# EAGLE design WZ2432R028-ESP32-V1.0-20230327 (EAGLE 9.5.1)
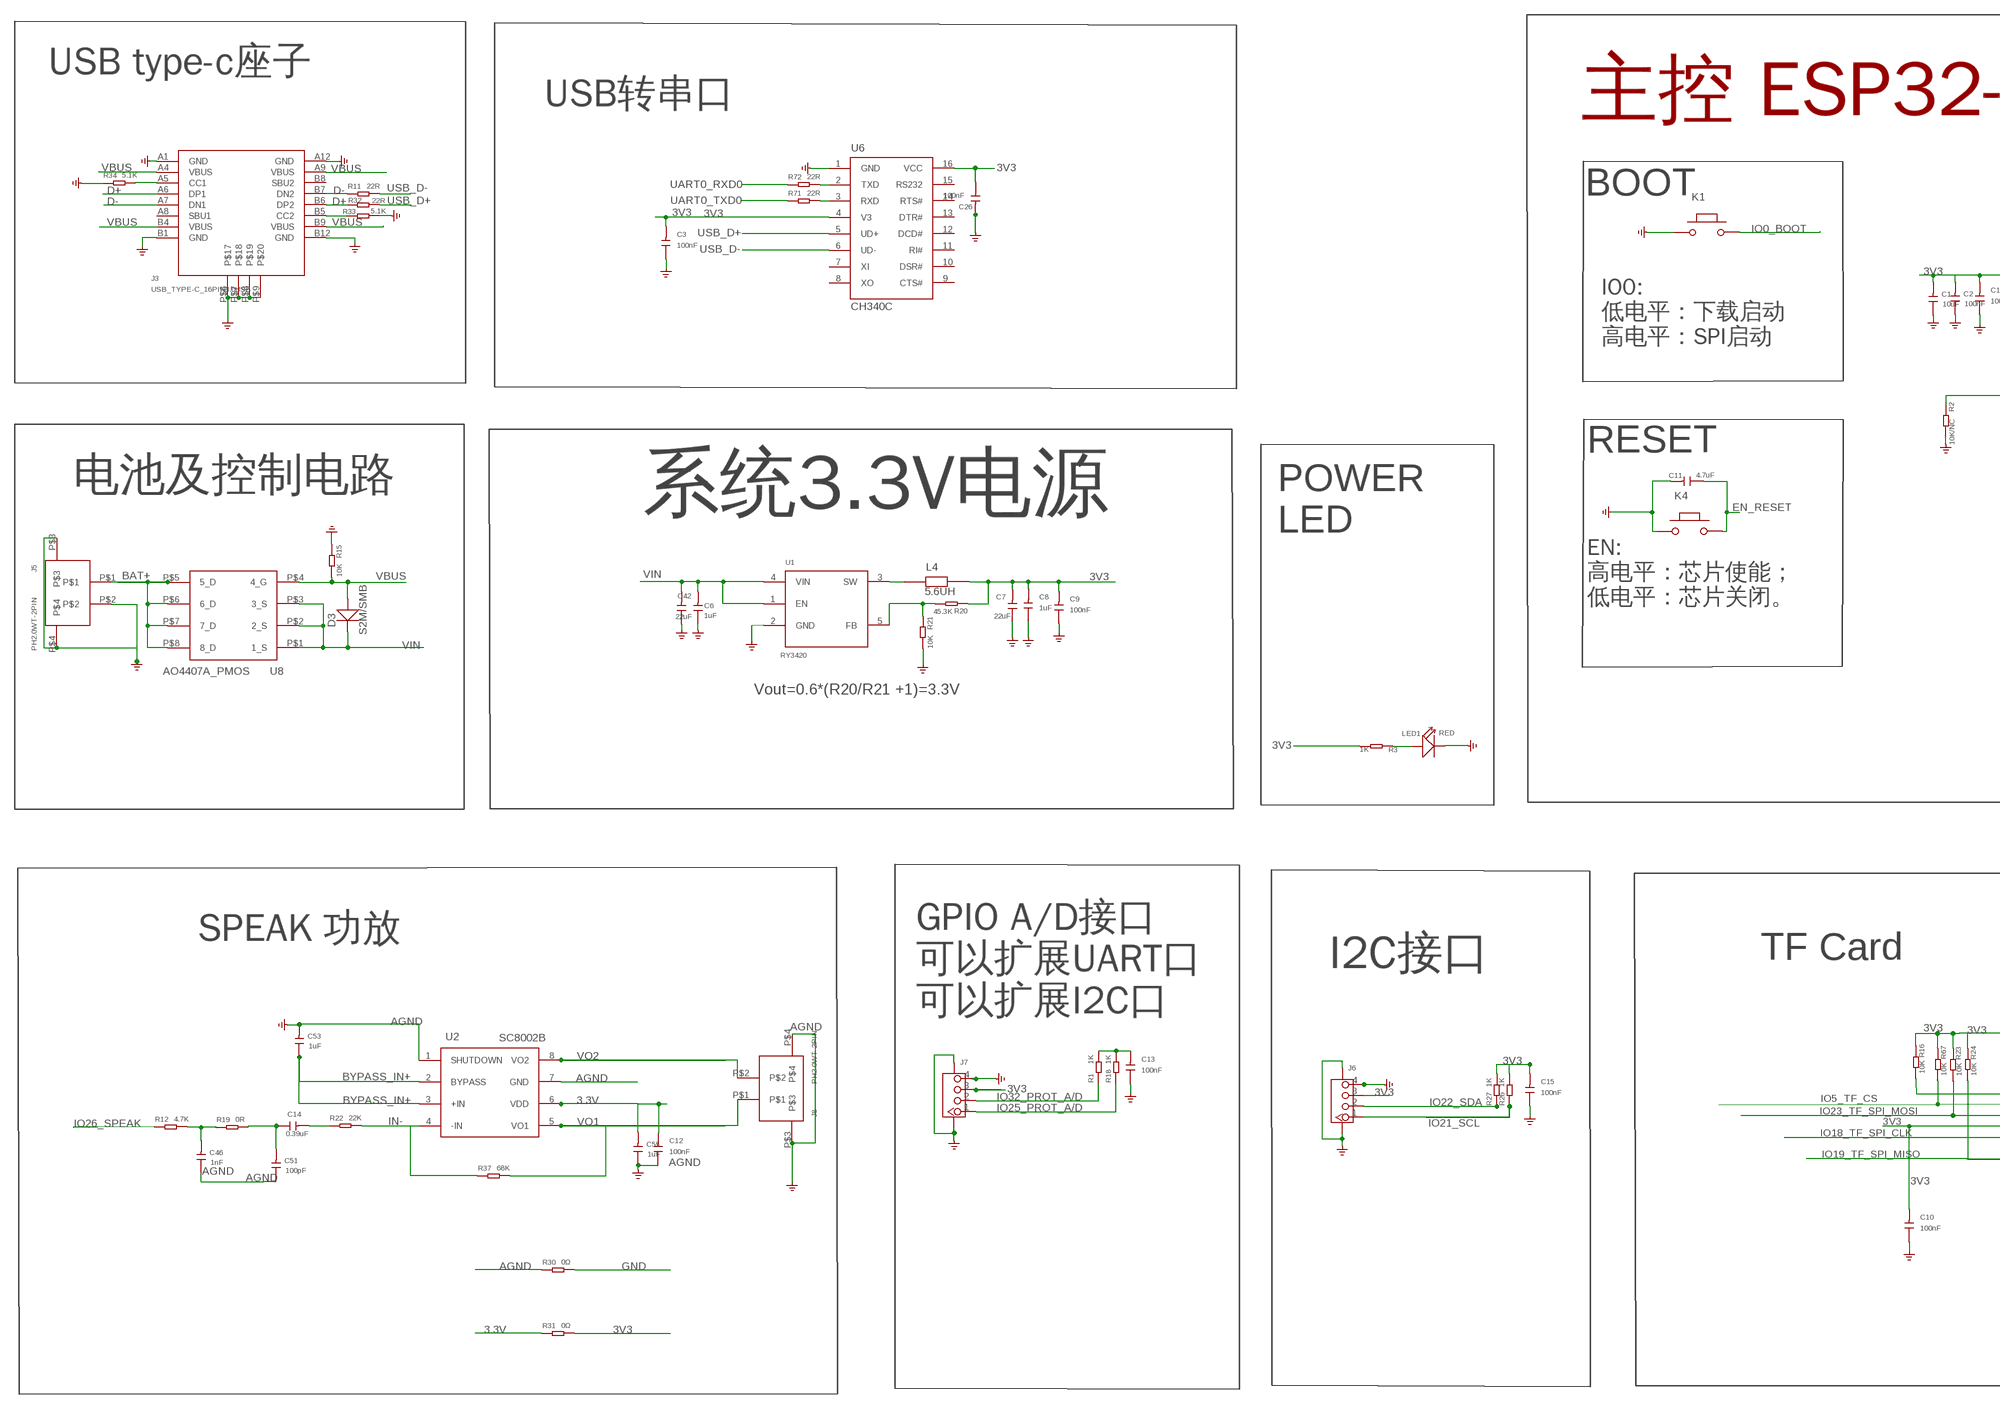
[diagram p0: schematic, sheet 1, part 1 of 2]
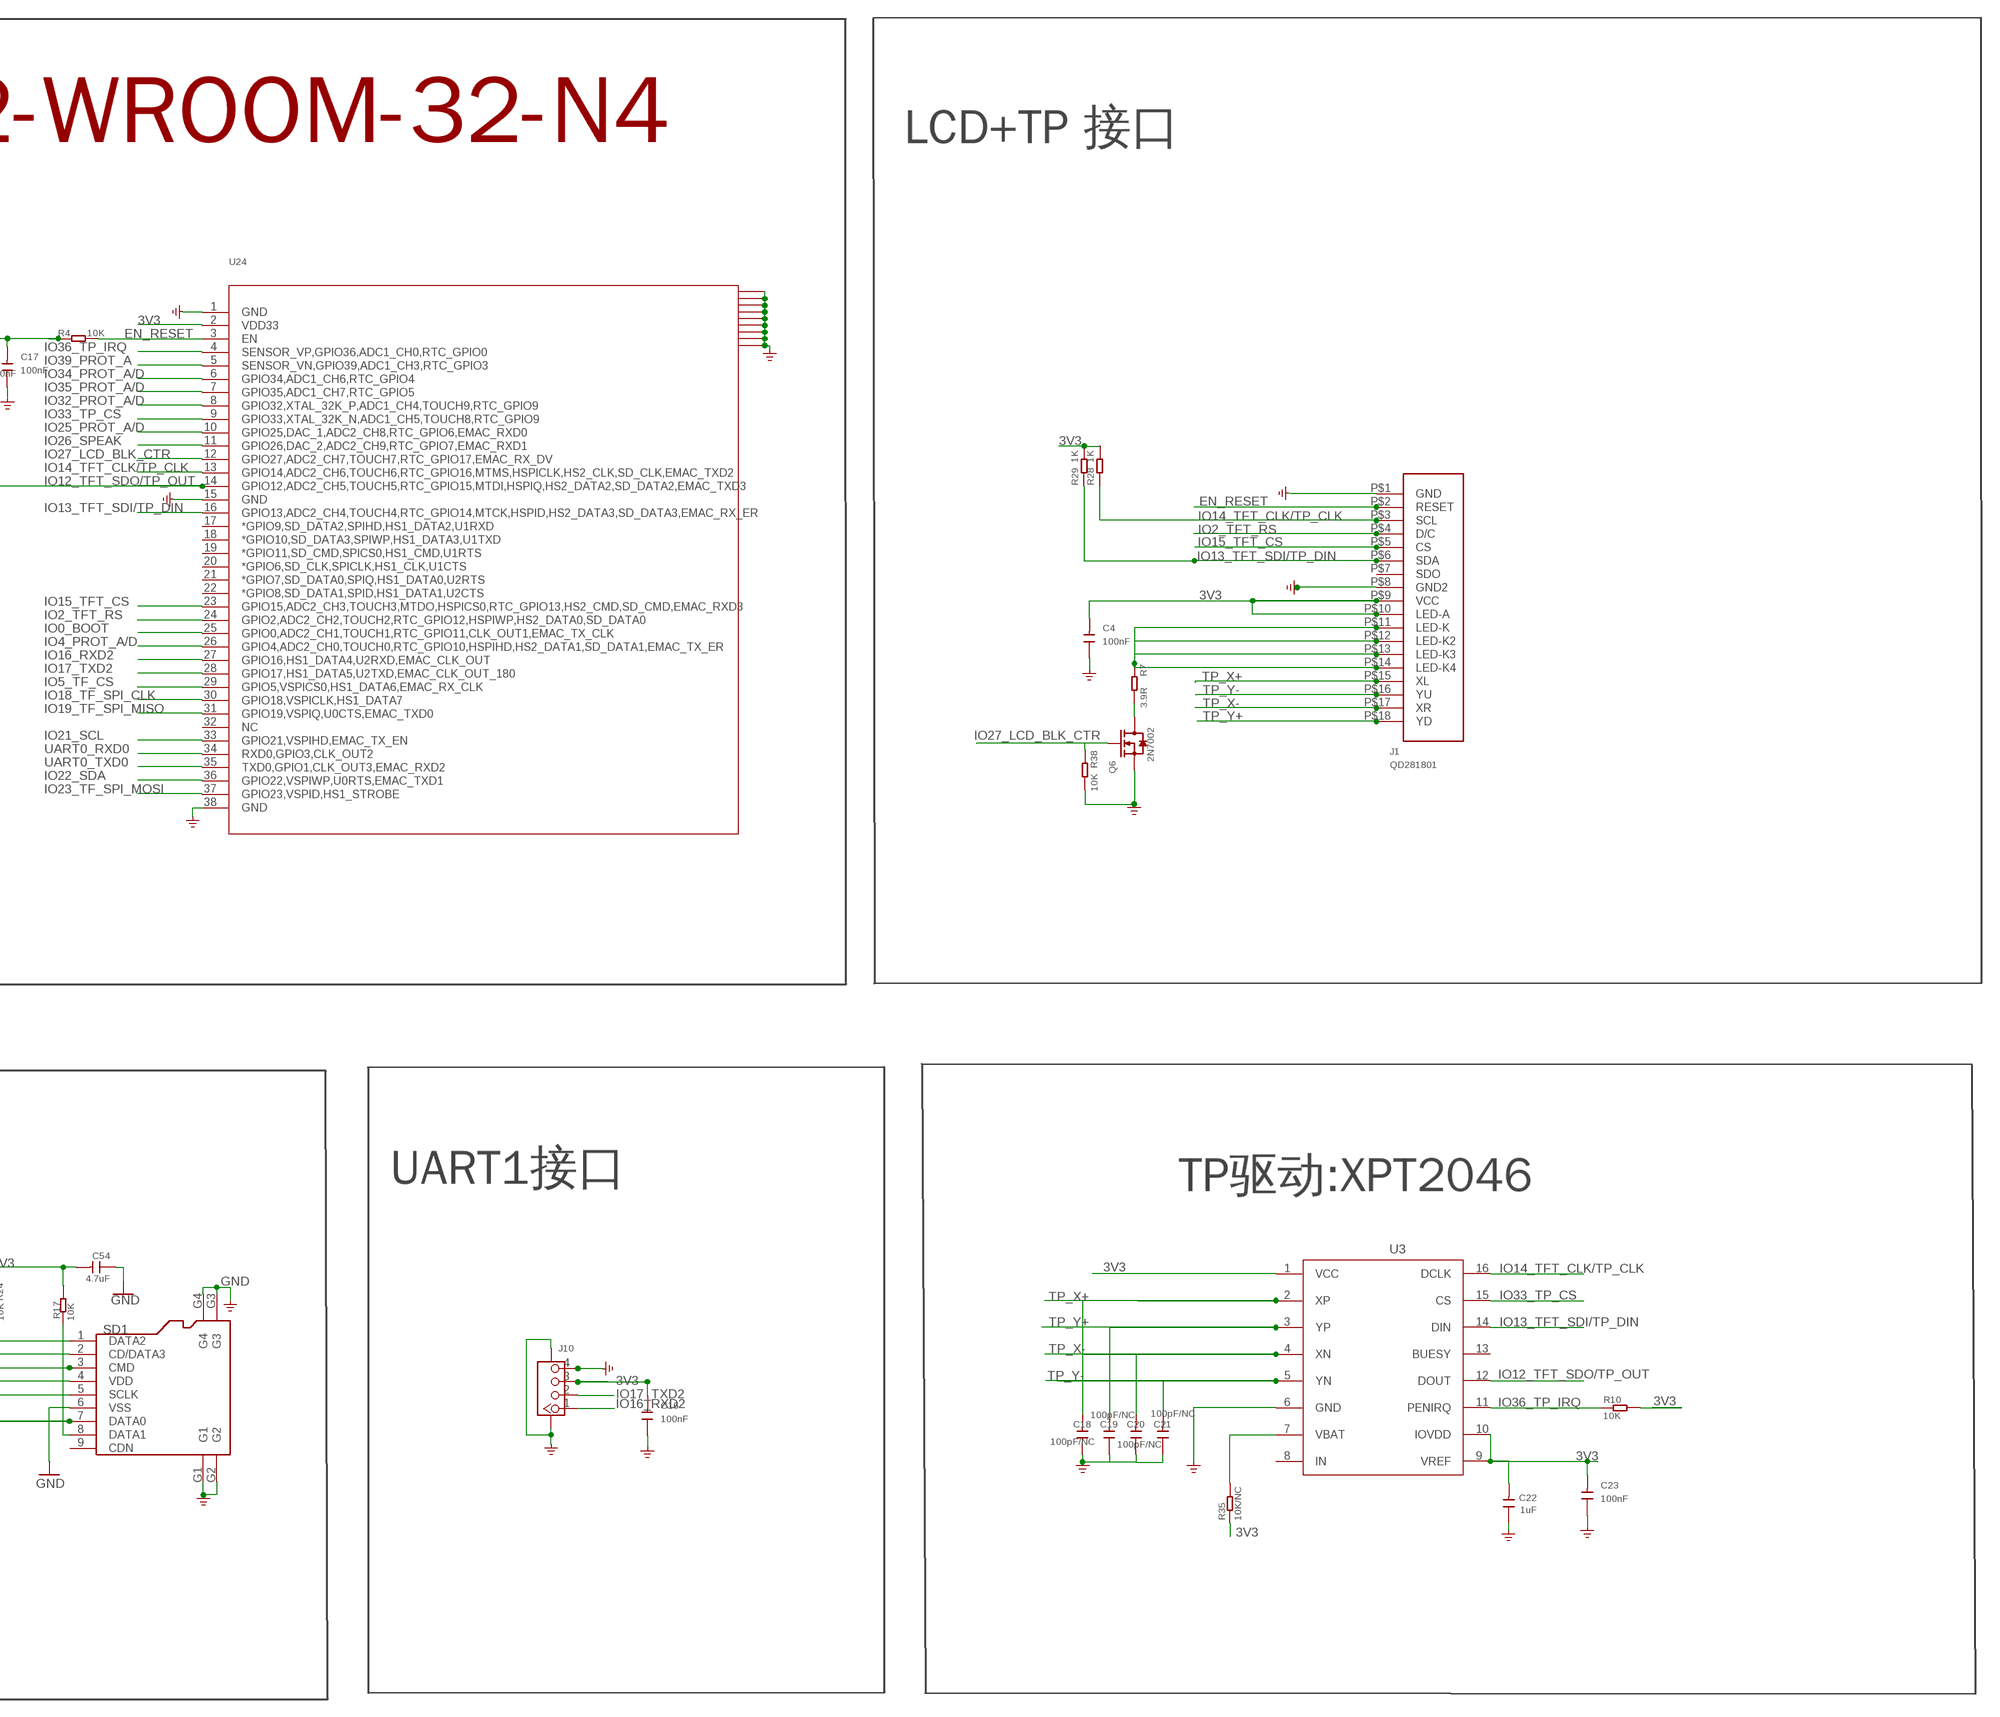
[diagram p1: schematic, sheet 1, part 2 of 2]

## Parts
C1  10uF  DISCRETE_C-0603  [DISCRETE_C0603]
C2  100nF  DISCRETE_C-0603  [DISCRETE_C0603]
C3  100nF  C0603  [0603]
C4  100nF  C0603  [0603]
C6  1uF  C0603  [0603]
C7  22uF  C0805  [0805]
C8  1uF  C0603  [0603]
C9  100nF  C0603  [0603]
C10  100nF  C0603  [0603]
C11  4.7uF  C0603  [0603]
C12  100nF  C0603  [0603]
C13  100nF  C0603  [0603]
C14  0.39uF  DISCRETE_C-0603  [DISCRETE_C0603]
C15  100nF  C0603  [0603]
C16  100nF  C0603  [0603]
C17  100nF  C0603  [0603]
C18  100pF/NC  C0603  [0603]
C19  100pF/NC  C0603  [0603]
C20  100pF/NC  C0603  [0603]
C21  100pF/NC  C0603  [0603]
C22  1uF  DISCRETE_C-0603  [DISCRETE_C0603]
C23  100nF  C0603  [0603]
C26  100nF  C0603  [0603]
C42  22uF  C0805  [0805]
C46  1nF  DISCRETE_C-0603  [DISCRETE_C0603]
C51  100pF  DISCRETE_C-0603  [DISCRETE_C0603]
C53  1uF  DISCRETE_C-0603  [DISCRETE_C0603]
C54  4.7uF  DISCRETE_C-0603  [DISCRETE_C0603]
C55  1uF  DISCRETE_C-0603  [DISCRETE_C0603]
D3  S2M/SMB  214ABDO-214AB  [214AB]
J1  QD281801  [QD241801-18PIN*0.8]
J3  USB_TYPE-C_16PIN3.0USB  [KEVIN_3.0TYPEC-SMD]
J5  PH2.0WT-2PIN  [PH2.0WT-2PIN]
J6  CONNECTOR_TWIG-4P-2.0-SMD-FEMALE-REINFORCE90D  [CONNECTOR_4P-SMD-2.0-90D]
J7  CONNECTOR_TWIG-4P-2.0-SMD-FEMALE-REINFORCE90D  [CONNECTOR_4P-SMD-2.0-90D]
J8  PH2.0WT-2PIN  [PH2.0WT-2PIN]
J10  CONNECTOR_TWIG-4P-2.0-SMD-FEMALE-REINFORCE90D  [CONNECTOR_4P-SMD-2.0-90D]
K1  BUTTON  PB157  [157SW]
K4  BUTTON  PB157  [157SW]
L4  5.6UH  CROWPI2-MB-V1.4-20211012_CMP201209UD1R0MT  [CD54]
LED1  RED  DISCRETE_LED0603  [DISCRETE_LED-0603]
Q6  2N7002  MOSFET-N'SOT23'  [SOT23]
R1  1K  DISCRETE_R-0603  [DISCRETE_R0603]
R2  10K/NC  DISCRETE_R-0603  [DISCRETE_R0603]
R3  1K  DISCRETE_R-0603  [DISCRETE_R0603]
R4  10K  R0603  [R0603]
R7  3.9R  DISCRETE_R-0603  [DISCRETE_R0603]
R10  10K  DISCRETE_R-0603  [DISCRETE_R0603]
R11  22R  DISCRETE_R-0603  [DISCRETE_R0603]
R12  4.7K  DISCRETE_R-0603  [DISCRETE_R0603]
R15  10K  DISCRETE_R-0603  [DISCRETE_R0603]
R16  10K  DISCRETE_R-0603  [DISCRETE_R0603]
R17  10K  DISCRETE_R-0603  [DISCRETE_R0603]
R18  1K  DISCRETE_R-0603  [DISCRETE_R0603]
R19  0R  DISCRETE_R-0603  [DISCRETE_R0603]
R20  45.3K  DISCRETE_R-0603  [DISCRETE_R0603]
R21  10K  DISCRETE_R-0603  [DISCRETE_R0603]
R22  22K  DISCRETE_R-0603  [DISCRETE_R0603]
R23  10K  DISCRETE_R-0603  [DISCRETE_R0603]
R24  10K  DISCRETE_R-0603  [DISCRETE_R0603]
R26  1K  DISCRETE_R-0603  [DISCRETE_R0603]
R27  1K  DISCRETE_R-0603  [DISCRETE_R0603]
R28  1K  DISCRETE_R-0603  [DISCRETE_R0603]
R29  1K  DISCRETE_R-0603  [DISCRETE_R0603]
R30  0Ω  DISCRETE_R-0603  [DISCRETE_R0603]
R31  0Ω  DISCRETE_R-0603  [DISCRETE_R0603]
R32  22R  DISCRETE_R-0603  [DISCRETE_R0603]
R33  5.1K  DISCRETE_R-0603  [DISCRETE_R0603]
R34  5.1K  DISCRETE_R-0603  [DISCRETE_R0603]
R35  10K/NC  DISCRETE_R-0603  [DISCRETE_R0603]
R37  68K  DISCRETE_R-0603  [DISCRETE_R0603]
R38  10K  DISCRETE_R-0603  [DISCRETE_R0603]
R67  10K  DISCRETE_R-0603  [DISCRETE_R0603]
R71  22R  DISCRETE_R-0603  [DISCRETE_R0603]
R72  22R  DISCRETE_R-0603  [DISCRETE_R0603]
SD1  HOLDER-MICROSD-9P  [9P-SMD-W/-RING]
U1  RY3420  A_XBJ_HM3420B  [A_XBJ_SOT23-5]
U2  SC8002B  SC8002BSC8002B-SOP8  [AT24C02_SOP8]
U3  XP2046  [XP2046-SSOP16]
U6  CH340C  CH340G  [SOP-16]
U8  AO4407A_PMOS  T_PMOS_AO4407A_SOP8  [SOP8]
U24  ESP32-WROOM-32-N4  [ESP32-WROOM-32-N4]

## Nets
3.3V: C12.2 C55.2 R31.1 U2.6(VDD)
3V3: C1.2 C2.2 C3.2 C4.2 C7.2 C8.2 C9.2 C10.2 C13.2 C15.2 C16.2 C17.2 C22.2 C23.2 C26.1 C54.2 J1.P$9(VCC) J1.P$10(LED-A) J6.3 J7.3 J10.3 L4.2 R1.2 R3.2 R4.1 R10.2 R16.1 R17.1 R18.2 R20.1 R23.1 R24.1 R26.2 R27.2 R28.2 R29.2 R31.2 R35.1 R67.1 SD1.4(VDD) U3.1(VCC) U3.9(VREF) U3.10(IOVDD) U6.4(V3) U6.16(VCC) U24.2(VDD33)
AGND: C12.1 C46.1 C51.1 C53.2 C55.1 J8.P$3 J8.P$4 R30.1 U2.1(SHUTDOWN) U2.7(GND) ; supply symbol labelled GND
BAT+: J5.P$1 U8.P$5(5_D) U8.P$6(6_D) U8.P$7(7_D) U8.P$8(8_D)
BYPASS_IN+: C53.1 U2.2(BYPASS) U2.3(+IN)
D+: J3.A6(DP1) J3.B6(DP2) R32.1
D-: J3.A7(DN1) J3.B7(DN2) R11.1
EN_RESET: C11.1 J1.P$2(RESET) K4.2 R4.2 U24.3(EN)
GND: C1.1 C2.1 C3.1 C4.1 C6.1 C7.1 C8.1 C9.1 C10.1 C11.2 C13.1 C15.1 C16.1 C17.1 C18.1 C19.1 C20.1 C21.1 C22.1 C23.1 C26.2 C42.1 C54.1 J1.P$1(GND) J1.P$8(GND2) J3.A1(GND) J3.A12(GND) J3.B1(GND) J3.B12(GND) J3.P$6 J3.P$7 J3.P$8 J3.P$9 J5.P$2 J5.P$3 J5.P$4 J6.4 J6.SS1 J6.SS2 J7.4 J7.SS1 J7.SS2 J10.4 J10.SS1 J10.SS2 K1.1 K4.1 LED1.- Q6.2(S) R2.2 R15.1 R21.2 R30.2 R33.2 R34.1 R38.2 SD1.6(VSS) SD1.G1 SD1.G2 SD1.G3 SD1.G4 U1.2(GND) U3.6(GND) U6.1(GND) U24.1(GND) U24.15(GND) U24.38(GND) U24.41(GND) U24.42(GND) U24.43(GND) U24.44(GND) U24.45(GND) U24.46(GND) U24.47(GND) U24.48(GND) U24.49(GND)
IN-: R22.2 R37.1 U2.4(-IN)
IO0_BOOT: K1.2 U24.25(GPIO0,ADC2_CH1,TOUCH1,RTC_GPIO11,CLK_OUT1,EMAC_TX_CLK)
IO2_TFT_RS: J1.P$4(D/C) U24.24(GPIO2,ADC2_CH2,TOUCH2,RTC_GPIO12,HSPIWP,HS2_DATA0,SD_DATA0)
IO4_PROT_A/D: U24.26(GPIO4,ADC2_CH0,TOUCH0,RTC_GPIO10,HSPIHD,HS2_DATA1,SD_DATA1,EMAC_TX_ER)
IO5_TF_CS: R67.2 SD1.2(CD/DATA3) U24.29(GPIO5,VSPICS0,HS1_DATA6,EMAC_RX_CLK)
IO12_TFT_SDO/TP_OUT: R2.1 U3.12(DOUT) U24.14(GPIO12,ADC2_CH5,TOUCH5,RTC_GPIO15,MTDI,HSPIQ,HS2_DATA2,SD_DATA2,EMAC_TXD3)
IO13_TFT_SDI/TP_DIN: J1.P$6(SDA) R29.1 U3.14(DIN) U24.16(GPIO13,ADC2_CH4,TOUCH4,RTC_GPIO14,MTCK,HSPID,HS2_DATA3,SD_DATA3,EMAC_RX_ER)
IO14_TFT_CLK/TP_CLK: J1.P$3(SCL) R28.1 U3.16(DCLK) U24.13(GPIO14,ADC2_CH6,TOUCH6,RTC_GPIO16,MTMS,HSPICLK,HS2_CLK,SD_CLK,EMAC_TXD2)
IO15_TFT_CS: J1.P$5(CS) U24.23(GPIO15,ADC2_CH3,TOUCH3,MTDO,HSPICS0,RTC_GPIO13,HS2_CMD,SD_CMD,EMAC_RXD3)
IO16_RXD2: J10.1 U24.27(GPIO16,HS1_DATA4,U2RXD,EMAC_CLK_OUT)
IO17_TXD2: J10.2 U24.28(GPIO17,HS1_DATA5,U2TXD,EMAC_CLK_OUT_180)
IO18_TF_SPI_CLK: SD1.5(SCLK) U24.30(GPIO18,VSPICLK,HS1_DATA7)
IO19_TF_SPI_MISO: R24.2 SD1.7(DATA0) U24.31(GPIO19,VSPIQ,U0CTS,EMAC_TXD0)
IO21_SCL: J6.1 R26.1 U24.33(GPIO21,VSPIHD,EMAC_TX_EN)
IO22_SDA: J6.2 R27.1 U24.36(GPIO22,VSPIWP,U0RTS,EMAC_TXD1)
IO23_TF_SPI_MOSI: R23.2 SD1.3(CMD) U24.37(GPIO23,VSPID,HS1_STROBE)
IO25_PROT_A/D: J7.1 R18.1 U24.10(GPIO25,DAC_1,ADC2_CH8,RTC_GPIO6,EMAC_RXD0)
IO26_SPEAK: R12.1 U24.11(GPIO26,DAC_2,ADC2_CH9,RTC_GPIO7,EMAC_RXD1)
IO27_LCD_BLK_CTR: Q6.1(G) R38.1 U24.12(GPIO27,ADC2_CH7,TOUCH7,RTC_GPIO17,EMAC_RX_DV)
IO32_PROT_A/D: J7.2 R1.1 U24.8(GPIO32,XTAL_32K_P,ADC1_CH4,TOUCH9,RTC_GPIO9)
IO33_TP_CS: U3.15(CS) U24.9(GPIO33,XTAL_32K_N,ADC1_CH5,TOUCH8,RTC_GPIO9)
IO34_PROT_A/D: U24.6(GPIO34,ADC1_CH6,RTC_GPIO4)
IO35_PROT_A/D: U24.7(GPIO35,ADC1_CH7,RTC_GPIO5)
IO36_TP_IRQ: R10.1 U3.11(PENIRQ) U24.4(SENSOR_VP,GPIO36,ADC1_CH0,RTC_GPIO0)
IO39_PROT_A: U24.5(SENSOR_VN,GPIO39,ADC1_CH3,RTC_GPIO3)
N$1: LED1.+ R3.1
N$2: Q6.3(D) R7.2
N$3: C46.2 R12.2 R19.1
N$4: R35.2 U3.7(VBAT)
N$12: J1.P$11(LED-K) J1.P$12(LED-K2) J1.P$13(LED-K3) J1.P$14(LED-K4) R7.1
N$13: L4.1 U1.3(SW)
N$14: J3.B5(CC2) R33.1
N$16: J3.A5(CC1) R34.2
N$20: R20.2 R21.1 U1.5(FB)
N$26: C14.1 C51.2 R19.2
N$29: C14.2 R22.1
N$40: R72.2 U6.2(TXD)
N$42: R71.2 U6.3(RXD)
N$47: R16.2 SD1.1(DATA2)
N$48: R17.2 SD1.8(DATA1)
TP_X+: C18.2 J1.P$15(XL) U3.2(XP)
TP_X-: C20.2 J1.P$17(XR) U3.4(XN)
TP_Y+: C19.2 J1.P$18(YD) U3.3(YP)
TP_Y-: C21.2 J1.P$16(YU) U3.5(YN)
UART0_RXD0: R72.1 U24.34(RXD0,GPIO3,CLK_OUT2)
UART0_TXD0: R71.1 U24.35(TXD0,GPIO1,CLK_OUT3,EMAC_RXD2)
USB_D+: R32.2 U6.5(UD+)
USB_D-: R11.2 U6.6(UD-)
VBUS: D3.1(+) J3.A4(VBUS) J3.A9(VBUS) J3.B4(VBUS) J3.B9(VBUS) R15.2 U8.P$4(4_G)
VIN: C6.2 C42.2 D3.2(-) U1.1(EN) U1.4(VIN) U8.P$1(1_S) U8.P$2(2_S) U8.P$3(3_S)
VO1: J8.P$1 R37.2 U2.5(VO1)
VO2: J8.P$2 U2.8(VO2)
Unconnected: J1.P$7(SDO) J3.A8(SBU1) J3.B8(SBU2) SD1.9(CDN) U3.8(IN) U3.13(BUESY) U6.7(XI) U6.8(XO) U6.9(CTS#) U6.10(DSR#) U6.11(RI#) U6.12(DCD#) U6.13(DTR#) U6.14(RTS#) U6.15(RS232) U24.17(*GPIO9,SD_DATA2,SPIHD,HS1_DATA2,U1RXD) U24.18(*GPIO10,SD_DATA3,SPIWP,HS1_DATA3,U1TXD) U24.19(*GPIO11,SD_CMD,SPICS0,HS1_CMD,U1RTS) U24.20(*GPIO6,SD_CLK,SPICLK,HS1_CLK,U1CTS) U24.21(*GPIO7,SD_DATA0,SPIQ,HS1_DATA0,U2RTS) U24.22(*GPIO8,SD_DATA1,SPID,HS1_DATA1,U2CTS) U24.32(NC)

## Notes on the sheet
- USB type-c座子
- USB转串口 | 主控 ESP32-WROOM-32-N4 | LCD+TP 接口
- BOOT
- IO0:
  低电平：下载启动
  高电平：SPI启动
- RESET
- 电池及控制电路
- 系统3.3V电源
- POWER
  LED
- EN:
  高电平：芯片使能；
  低电平：芯片关闭。
- Vout=0.6*(R20/R21 +1)=3.3V
- SPEAK 功放
- I2C接口 | TF Card | UART1接口
- TP驱动:XPT2046
- GPIO A/D接口
  可以扩展UART口
  可以扩展I2C口

## Library data of the parts
C1 C2 C14 C22 C46 C51 C53 C55 = A_xbj:DISCRETE_C*: Ceramic Capacitors
C3 C4 C6 C8-C13 C15-C21 C23 C26 = A_xbj:C0603
C7 C42 = A_xbj:C0805
C54 = A9G:DISCRETE_C*: Ceramic Capacitors
D3 = DO-214AB:214AB: 214AB
J1 = cooper:QD281801
J3 = WZ3532R024-ESP32-V0.1-20221226:USB_TYPE-C_16PIN
J5 J8 = cooper:PH2.0WT-2PIN
J6 J7 J10 = A_xbj:CONNECTOR_TWIG-4P-2.0-SMD-FEMALE-REINFORCE
K1 K4 = MySMD:PB157
L4 = CD54:CROWPI2-MB-V1.4-20211012_CMP201209UD1R0MT
LED1 = A_xbj:DISCRETE_LED*
Q6 = discrete:MOSFET-N: IRLL014: http://www.vishay.com/docs/91319/sihll014.pdf
R1-R3 R7 R11 R12 R15-R24 R26-R34 R37 R38 R67 R71 R72 = Crowtail-_LED-V2.0-20190615-01:DISCRETE_R*
R4 = A_xbj:R0603
R10 R35 = A9G:DISCRETE_R*
SD1 = Connector:HOLDER-MICROSD-9P
U1 = CrowBot_-V1.0-20220525:A_XBJ_HM3420B
U2 = cooper:SC8002B
U3 = cooper:XP2046
U6 = A_xbj:CH340G
U8 = cooper:T_PMOS_AO4407A_SOP8
U24 = cooper:ESP32-WROOM-32-N4

## Net classes
0 default: width 0.152 mm, drill 0.3 mm, clearance 0.152 mm

## Board
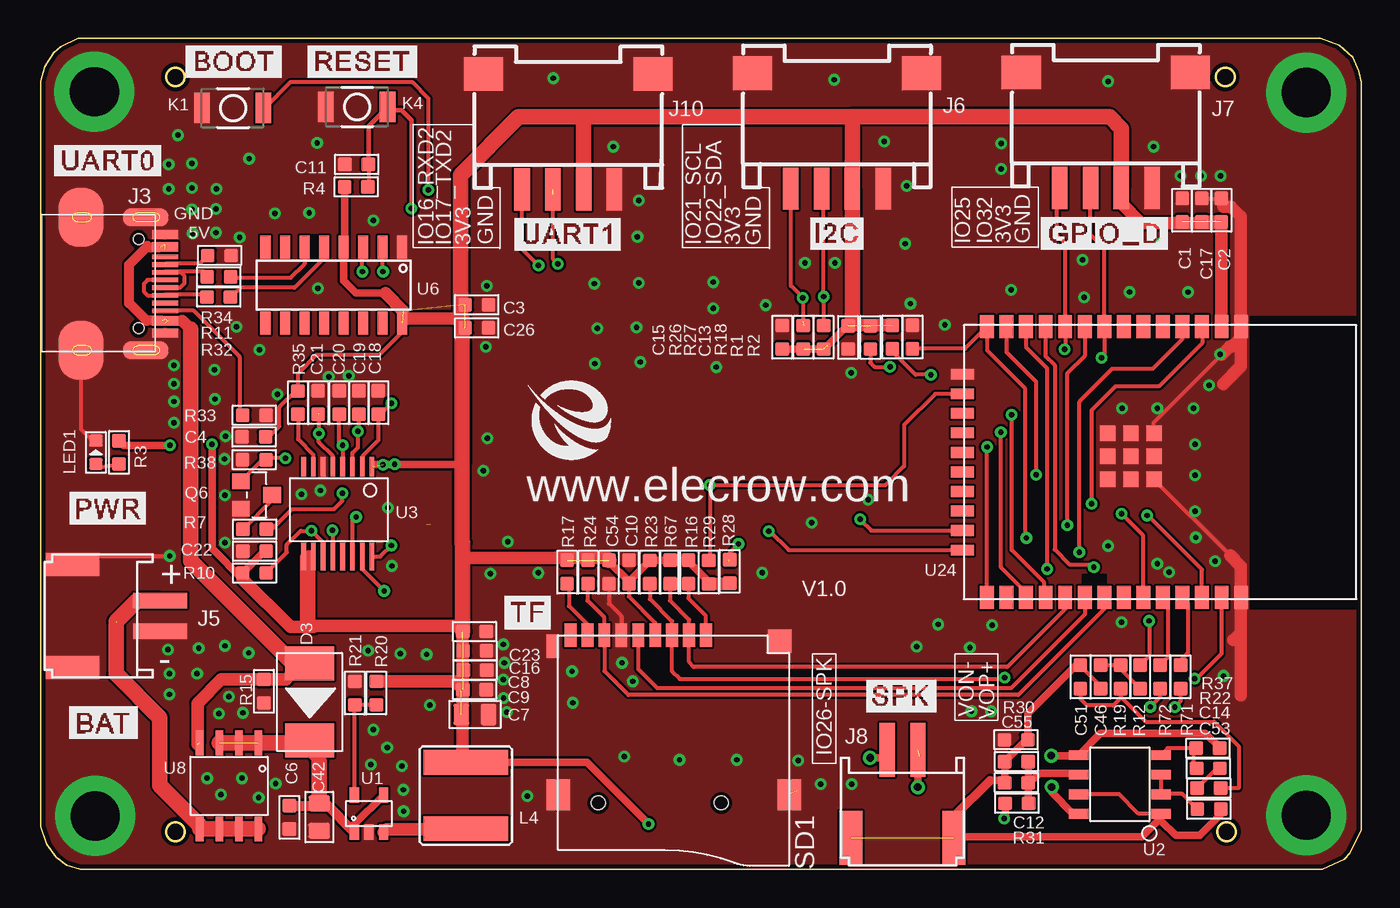
[diagram p2: board, top side]
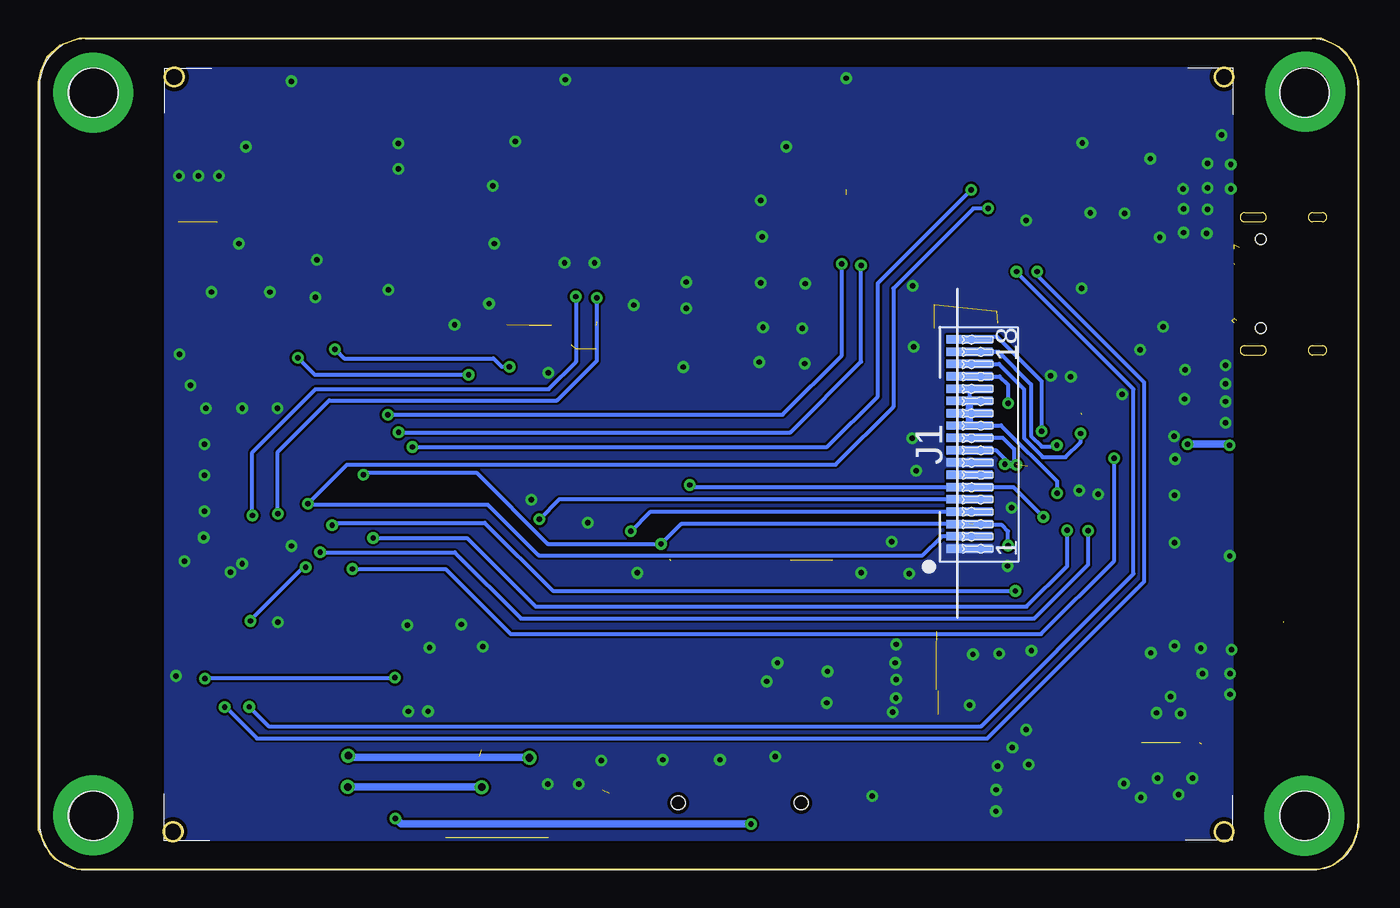
[diagram p3: board, bottom side, seen from below]

Size 85.8 x 54 mm. Coordinates in mm from the lower left corner, seen from the top.
Outline: 83.16,54 84.38,53.56 85.25,52.77 85.65,51.88 85.8,51.16 85.8,2.55 85.06,1.03 84.71,0.66 83.28,0 2.57,0 1.7,0.28 1.01,0.77 0.38,1.61 0,2.75 0,51.24 0.27,52.16 0.86,53.08 1.3,53.47 2.44,54 83.16,54
Outline: circle at 76.98,51.5 radius 0.59
Outline: circle at 8.77,2.44 radius 0.59
Outline: circle at 77.06,2.44 radius 0.59
Outline: circle at 8.77,51.5 radius 0.59
Copper layers (1*16): Top 0.035mm / dielectric 1.5mm / Bottom 0.035mm
Design rules "default *": minimum track width 6mil, minimum drill 0.35mm, track to track 6mil, track to pad 5mil, pad to pad 5mil, via to via 6mil, smd to smd 6mil, copper to edge 10mil, drill to drill 10mil, minimum pad ring 10mil, minimum via ring 8mil, stop-mask expansion 4mil, vias tented up to drill 100mil, thermal gap 0mil
tRestrict: area 21.1,130.4 to 30.9,149.4
bRestrict: area 21.1,130.4 to 30.9,149.4

### Footprints (pad centres in the part's own frame; a part is rotated, then mirrored left to right if it is on the bottom)
DISCRETE_C0603 = smd 0.889 x 0.889: 1 -0.762,0; 2 0.762,0
0603 = smd 0.889 x 0.889: 1 -0.762,0; 2 0.762,0
0805 = smd 1.016 x 1.397: 1 -0.889,0; 2 0.889,0
214AB = smd 2.2 x 3.2: 1 -2.5,0; 2 2.5,0
QD241801-18PIN*0.8 = smd 0.55 x 3: P$1 -6.789,-1.538; P$2 -5.989,-1.538; P$3 -5.189,-1.538; P$4 -4.389,-1.538; P$5 -3.589,-1.538; P$6 -2.789,-1.538; P$7 -1.989,-1.538; P$8 -1.189,-1.538; P$9 -0.389,-1.538; P$10 0.411,-1.538; P$11 1.211,-1.538; P$12 2.011,-1.538; P$13 2.811,-1.538; P$14 3.611,-1.538; P$15 4.411,-1.538; P$16 5.211,-1.538; P$17 6.011,-1.538; P$18 6.811,-1.538
KEVIN_3.0TYPEC-SMD = smd 0.3 x 1.7: A1 -3.35,0.5; A4 -2.55,0.5; A5 -1.25,0.5; A6 -0.25,0.5; A7 0.25,0.5; A8 1.25,0.5; A9 2.55,0.5; A12 3.35,0.5; B1 3.05,0.5; B4 2.25,0.5; B5 1.75,0.5; B6 0.75,0.5; B7 -0.75,0.5; B8 -1.75,0.5; B9 -2.25,0.5; B12 -3.05,0.5 | smd 1.143 x 2.921: P$6 -4.318,-0.762; P$7 4.318,-0.762 | smd 3.81 x 2.921: P$8 -4.318,-4.953; P$9 4.318,-4.953 | hole 0.68: -2.89,-1.22; 2.89,-1.22
PH2.0WT-2PIN = smd 1 x 3.5: P$1 -1,0; P$2 1,0 | smd 1.5 x 3.5: P$3 -3.35,-5.7; P$4 3.35,-5.7
CONNECTOR_4P-SMD-2.0-90D = smd 1.01 x 2.74: 1 -3,-0.1; 2 -1,-0.1; 3 1,-0.1; 4 3,-0.1 | smd 2.54 x 2.184: SS1 -5.5,7.4; SS2 5.5,7.4
157SW = smd 1.016 x 1.981: 1 0,0; 2 4,0
CD54 = smd 5.5 x 1.6: 1 0,2.159; 2 0,-2.159
DISCRETE_LED-0603 = smd 0.762 x 0.889: + -0.762,0; - 0.762,0
SOT23 = smd 1.016 x 1.143: 1 -0.889,-1.016; 2 0.889,-1.016; 3 0,1.016
DISCRETE_R0603 = smd 0.889 x 0.889: 1 -0.762,0; 2 0.762,0
R0603 = smd 0.889 x 0.889: 1 -0.762,0; 2 0.762,0
9P-SMD-W/-RING = smd 1.524 x 0.762: 1 0,4.4; 2 0,3.3; 3 0,2.2; 4 0,1.1; 5 0,0; 6 0,-1.1; 7 0,-2.2; 8 0,-3.3; 9 0,-4.4 | smd 1.524 x 0.8: G1 0.7,-5.546 | smd 2.032 x 1.524: G2 10.373,-5.2; G3 10.373,9.8 | smd 1.524 x 1.524: G4 0.392,9.181 | hole 0.889: 10.9,-2.6; 10.9,5.4
A_XBJ_SOT23-5 = smd 0.6 x 1: 1 -0.95,-1.2; 2 0,-1.2; 3 0.95,-1.2; 4 0.95,1.2; 5 -0.95,1.2
AT24C02_SOP8 = smd 0.635 x 1.27: 1 -1.905,-2.667; 2 -0.635,-2.667; 3 0.635,-2.667; 4 1.905,-2.667; 5 1.905,2.667; 6 0.635,2.667; 7 -0.635,2.667; 8 -1.905,2.667
XP2046-SSOP16 = smd 0.305 x 1.27: 1 -2.54,-2.54; 2 -1.905,-2.54; 3 -1.27,-2.54; 4 -0.635,-2.54; 5 0,-2.54; 6 0.635,-2.54; 7 1.27,-2.54; 8 1.905,-2.54 | smd 0.305 x 1.778: 9 1.905,3.302; 10 1.27,3.302; 11 0.635,3.302; 12 0,3.302; 13 -0.635,3.302; 14 -1.27,3.302; 15 -1.905,3.302; 16 -2.54,3.302
SOP-16 = smd 0.66 x 1.5: 1 -4.445,-2.475; 2 -3.175,-2.475; 3 -1.905,-2.475; 4 -0.635,-2.475; 5 0.635,-2.475; 6 1.905,-2.475; 7 3.175,-2.475; 8 4.445,-2.475; 9 4.445,2.475; 10 3.175,2.475; 11 1.905,2.475; 12 0.635,2.475; 13 -0.635,2.475; 14 -1.905,2.475; 15 -3.175,2.475; 16 -4.445,2.475
SOP8 = smd 0.5 x 1.6: P$1 -1.905,-2.8; P$2 -0.635,-2.8; P$3 0.635,-2.8; P$4 1.905,-2.8; P$5 1.905,2.8; P$6 0.635,2.8; P$7 -0.635,2.8; P$8 -1.905,2.8
ESP32-WROOM-32-N4 = smd 1.5 x 0.9: 1 -8.898,6.761; 2 -8.898,5.491; 3 -8.898,4.221; 4 -8.898,2.951; 5 -8.898,1.681; 6 -8.898,0.411; 7 -8.898,-0.859; 8 -8.898,-2.129; 9 -8.898,-3.399; 10 -8.898,-4.669; 11 -8.898,-5.939; 12 -8.898,-7.209; 13 -8.898,-8.479; 14 -8.898,-9.749; 25 8.702,-9.749; 26 8.702,-8.479; 27 8.702,-7.209; 28 8.702,-5.939; 29 8.702,-4.669; 30 8.702,-3.399; 31 8.702,-2.129; 32 8.702,-0.859; 33 8.702,0.411; 34 8.702,1.681; 35 8.702,2.951; 36 8.702,4.221; 37 8.702,5.491; 38 8.702,6.761 | smd 0.7 x 1.5: 15 -5.808,-11.349; 16 -4.538,-11.349; 17 -3.268,-11.349; 18 -1.998,-11.349; 19 -0.728,-11.349; 20 0.542,-11.349; 21 1.812,-11.349; 22 3.082,-11.349; 23 4.352,-11.349; 24 5.622,-11.349 | smd 1 x 1: 41 -0.484,-0.402; 42 1.016,-0.402; 43 -1.984,-0.402; 44 -1.984,-1.902; 45 -0.484,-1.902; 46 1.016,-1.902; 47 1.016,1.098; 48 -0.484,1.098; 49 -1.984,1.098

### Placement (x,y rotation side)
C1  74.18,42.84 270 top
C2  76.72,42.84 270 top
C3  28.34,36.69 180 top
C4  13.86,28.11 0 top
C6  16.17,3.38 90 top
C7  28.22,10.06 180 top
C8  28.22,12.95 180 top
C9  28.2,11.68 180 top
C10  38.23,19.33 270 top
C11  20.54,45.81 180 top
C12  63.41,5.63 0 top
C13  52.47,34.57 90 top
C14  75.9,5.28 180 top
C15  48.18,34.58 270 top
C16  28.22,14.22 180 top
C17  75.45,42.84 270 top
C18  21.94,30.33 270 top
C19  20.67,30.33 270 top
C20  19.4,30.33 270 top
C21  18.03,30.33 270 top
C22  13.9,20.68 0 top
C23  28.19,15.46 180 top
C26  28.34,35.19 0 top
C42  18.11,3.4 90 top
C46  68.88,12.51 90 top
C51  67.57,12.51 270 top
C53  75.92,3.91 0 top
C54  36.93,19.33 90 top
C55  63.41,7 0 top
D3  17.48,10.88 270 top
J1  26.84,27.63 90 bottom
J3  7.58,38.05 270 top
J5  7.77,16.47 270 top
J6  51.74,44.34 0 top
J7  69.21,44.39 0 top
J8  56.01,7.76 0 top
J10  34.28,44.29 0 top
K1  10.48,49.48 0 top
K4  18.54,49.55 0 top
L4  27.64,4.8 180 top
LED1  3.59,27.1 90 top
Q6  14.03,24.33 270 top
R1  55.35,34.6 90 top
R2  56.65,34.6 90 top
R3  5.1,27.1 90 top
R4  20.51,44.36 0 top
R7  13.91,22.1 180 top
R10  13.89,19.26 180 top
R11  11.58,38.51 0 top
R12  71.44,12.51 270 top
R15  14.51,11.58 90 top
R16  42.1,19.33 270 top
R17  34.21,19.33 270 top
R18  53.92,34.57 90 top
R19  70.17,12.51 270 top
R20  21.81,11.46 270 top
R21  20.42,11.46 90 top
R22  75.87,6.56 180 top
R23  39.59,19.32 270 top
R24  35.57,19.33 270 top
R26  49.55,34.58 270 top
R27  50.88,34.58 270 top
R28  44.77,19.36 270 top
R29  43.42,19.31 270 top
R30  63.39,8.42 180 top
R31  63.44,4.29 180 top
R32  11.57,37.19 0 top
R33  13.89,29.51 0 top
R34  11.62,39.89 180 top
R35  16.72,30.33 270 top
R37  75.85,7.87 0 top
R38  13.89,26.63 180 top
R67  40.92,19.33 270 top
R71  74.07,12.51 270 top
R72  72.74,12.51 270 top
SD1  38.83,15.22 270 top
U1  21.33,3.62 0 top
U2  70.13,5.52 90 top
U3  18.99,23.63 180 top
U6  19.05,37.96 180 top
U8  12.24,5.42 180 top
U24  71.24,26.37 270 top
U$2  [2.8板框]  -16.01,26.97 0 bottom  (outside the outline)
U$30  [ELECROW-NEW]  31.63,26.61 0 top

### Tracks (layer width: path | path; a pad name or v marks a point on that pad's centre or on a via)
1
  cutout Top: 17.5,41.25 18.05,41.25 18.05,39.7 17.5,39.7
  cutout Top: 67.7,18.6 67.7,19.15 69.25,19.15 69.25,18.6
  cutout Top: 73.65,11.3 73.1,11.3 73.1,12.85 73.65,12.85
  cutout Top: 35.2,17.45 34.65,17.45 34.65,19 35.2,19
3.3V
  Top 0.254: R31.1 64.2,5.54 | 64.2,5.6 C12.2
  Top 0.5: U2.6 67.38,6.23 64.89,6.23 64.2,5.54 | R31.1 64.2,5.6 | C12.2 C55.2
3V3  (via drill 0.35)  (16 unrouted)
  Top 0.152: U3.9 17.17,20.32 | U3.9 17.09,19.16 | U3.9 17.09,15.92 17.25,15.75
  Top 0.203: 27.33,11.58 C9.2 27.46,11.71 | C8.2 27.43,12.93
  Top 0.254: C10.2 38.23,17.72 39.93,16.02 SD1.4 | v62.6,3.3 62.68,3.38 | 14.55,20.68 C22.2 | 17.17,20.32 17.45,20.32 U3.10 | 23.81,35.8 U6.16 23.5,34.93 22.02,33.45 17.95,33.45 16.72,32.22 R35.1 16.56,31.09 15.5,30.03 15.5,28.78 14.82,28.11 C4.2 | R16.1 R67.1
  Top 0.5: 62.68,3.38 R31.2 | L4.2 35.49,6.96 v39.5,2.95 | C23.2 27.43,15.61 27.23,15.81 | R4.1 19.75,40.5 U6.4 19.69,38.26 20.5,37.45 22.4,37.45 | 38.23,18.7 36.93,19.99 C54.2 | 38.23,18.7 39.59,20.06 R23.1 R16.1 42.1,20 43.42,18.68 R29.2 | C10.2 38.23,18.7 | 52.74,35.65 52.47,35.38 51.16,34.07 | C15.2 R27.2 | 27.38,26.32 21.68,26.32 21.7,26.3 v22.25,26.3 | 13.13,18.86 11.13,20.85 v11.13,27.63 | v8.4,27.55 5.41,27.55 R3.2 | R10.2 14.55,20.68 | U3.9 17.09,16.17 17.45,15.81
  Top 0.8: L4.2 27.43,7.16 C23.2 | C9.2 26.9,12.22 R20.1 | R10.2 13.13,18.86 16.23,15.75 17.25,15.75 17.75,15.75 | 27.23,15.81 17.45,15.81 17.45,20.32 | 27.38,35.8 27.28,35.8 23.81,35.8 | J6.3 52.79,44.29 | J7.3 70.22,43.29 71.5,42 76.64,42 C2.2 | U24.2 76.73,41.82 76.47,42.08 C17.2 | 23.55,36.3 22.4,37.45 | R1.2 52.49,35.36 52.47,35.38 | 36.87,20.15 36.77,20.25 27.43,20.25 | R29.2 44.72,18.55 R28.2
  Top 1: C23.2 27.43,20.25 27.43,21.23 27.38,21.18 27.38,26.32 27.38,35.8 | C54.2 36.87,20.15 | 27.28,35.8 27.28,45.13 31.05,48.9 35.5,48.9 | 35.5,48.9 52.65,48.9 | 52.65,48.9 69.47,48.9 70.22,48.15 J7.3 | 52.74,35.65 J6.3 52.74,48.81 52.65,48.9 | 35.5,48.9 35.28,48.68 J10.3
  Bottom 0.254: J1.P$10 23.13,28.04 22.41,27.32 22.41,26.32 v23,26.32 23,26.65 23.59,27.24 J1.P$9
  Bottom 0.5: v62.6,3.3 62.25,2.95 v39.5,2.95 | v23,26.32 22.27,26.32 v22.25,26.3 | v11.13,27.63 8.48,27.63 v8.4,27.55
AGND  (1 unrouted)
  Top 0.254: C46.1 68.88,11.9 67.57,13.21 C51.1 67.57,13.32 | 64.01,8.42 R30.1 64.15,8.45 64.09,8.45 | C53.2 76.69,3.57 | U2.7 67.48,4.9 70.05,4.9 71.34,3.61 U2.1 72.79,3.35 72.79,3.16 | J8.P$4 59.36,3.44
  Top 0.5: 64.15,8.45 64.15,10.15 67.27,13.27 C51.1 | 64.09,8.45 C55.1 C12.1 62.5,5.78 61.7,5.78 | 76.69,3.57 75.31,2.2 73.75,2.2 72.79,3.16 | J8.P$4 59.4,2.1 71.54,2.1 72.79,3.35
  Top 0.58: 61.7,5.78 59.36,3.44
BAT+  (1 unrouted)
  Top 1: J5.P$1 6.27,17.47 4.9,16.1 | 4.9,16.05 4.9,12.7 7.75,9.85 7.75,5.46 10.34,2.88 U8.P$5 U8.P$6 U8.P$7 U8.P$8
BYPASS_IN+
  Top 0.254: U2.3 U2.2 72.81,4.9 74.17,4.9 C53.1
D+
  Top 0.254: R32.1 10.81,37.21 10.66,37.36 8.13,37.36 J3.B6 6.95,37.3 6.7,37.55 6.7,38.05 6.96,38.3 J3.A6
D-
  Top 0.254: R11.1 10.82,38.62 10.58,38.86 8.13,38.86 J3.B7 9.08,38.8 9.09,38.81 9.35,38.55 9.35,38.1 9.05,37.8 J3.A7
EN_RESET  (via drill 0.35)
  Top 0.254: U24.3 75.47,35.26 75.47,34.2 72.66,31.39 69.84,31.39 68.3,29.85 v68.3,23.75 | C11.1 21.3,44.39 R4.2
  Top 0.3: v24.1,42.95 24.1,48.7 23.45,49.35 22.74,49.35 | C11.1 21.3,48.3 K4.2
  Top 0.5: 22.74,49.35 K4.2
  Bottom 0.254: J1.P$2 27.1,21.64 28.34,20.4 53.3,20.4 56.6,23.7 68.25,23.7 v68.3,23.75 65.75,26.3 34,26.3 30.25,30.05 30.25,37.75 25.05,42.95 v24.1,42.95
GND  (via drill 0.35, 3.2 pad 5.2)  (1 unrouted)
  Top 0.203: C42.1 17.72,2.9 | C7.1 29.26,9.91 | C9.1 29.11,11.53 | 28.96,12.93 C8.1
  Top 0.254: C54.1 36.93,17.27 37.73,16.47 SD1.6 | 49.13,5.14 48.4,4.41 | 48.72,4.93 SD1.G3 | 62.48,8.57 R30.2 | U24.49 72.34,29.04 76.75,33.45 | 77.3,20.4 U24.47 | LED1.- 3.59,27.63 2.63,28.59 J3.P$9 | 2.34,19.72 J5.P$3 2.62,20.37 v8.38,20.37 | C17.1 C2.1
  Top 0.8: 76.75,33.45 77.26,33.96 77.41,33.96 78,34.55 U24.1 | U24.1 78,32.7 76.85,31.55 | U24.38 78,19.69 77.3,20.4 | U24.38 78,15.4 77.5,14.9 | 76.85,43.08 77.33,43.08 78,42.4 U24.1 | U24.38 78,11.3
  other vias: 38.87,43.47 3.54,3.46 13.55,46.19 58.76,35.38 15.23,42.63 17.45,42.67 3.49,50.54 82.24,3.51 82.24,50.49 51.57,51.32 75.02,25.62 75.02,27.62 75.92,31.47 49.22,7.07 72.57,19.87 69.37,21.02 21.62,9.07 23.47,6.72 13.07,5.92 30.07,12.32 10.82,5.92 11.72,4.87 23.57,5.17 18.72,32.02 12.72,35.27 52.67,32.27 47.12,36.67 8.32,44.22 11.99,24.31 8.37,12.72 38.97,32.97 69.37,51.22 54.82,47.32 8.92,47.72 37.22,46.97 14.22,33.77 62.42,47.17 17.97,47.22 76.87,12.57 33.32,51.42 70.27,29.97 63.07,37.67 41.52,7.12 72.77,40.67 62.42,45.52 38.78,41.12 72.57,29.97 22.55,23.49 18.02,37.77 28.93,33.97 21.63,42.17 22.83,19.72 21.28,14.22 23.58,3.77 8.67,30.4 58.33,15.92 30.13,13.42 13.13,10.17 30.07,14.62 45.23,7.12 16.93,24.37 37.93,7.32 11.93,26.67 11.32,30.57 23.38,14.02 25.08,13.97 56.28,44.42 34.58,10.82 30.08,11.12 56.18,40.67 11.97,21.22 12.02,28.15 70.23,16.07 61.83,15.87 60.38,14.42 60.48,10.27 21.47,6.82 15.27,5.57 14.17,4.67 34.53,12.87 37.78,13.42 38.48,12.22 15.38,30.87 20.02,32.07 28.98,37.92 12.93,41.08 11.38,41.38 9.83,44.28 56.52,36.77 72.32,46.97 74.07,45.07 75.42,45.07 76.67,45.07 76.63,33.47 70.77,37.52 74.57,37.52 53.77,24.01 50.11,22.54 61.77,10.27 52.7,5.55 50.68,5.55 31.62,4.77 18.17,24.62 30.28,10.22 29.23,19.22 32.33,19.27 46.88,19.27 10.27,14.37 8.27,14.27 8.66,32.75 8.66,31.55 11.28,32.47 25.28,10.67 74.92,29.97 75.02,23.27 43.91,32.64 11.97,14.52 13.52,14.07 8.37,11.37 9.88,41.33 8.32,45.82 9.83,45.88 9.83,42.88 10.17,12.72 22.52,7.92 38.87,38.12 8.67,29.02 11.43,44.23 11.38,42.93 73.32,19.32 76.32,20.02 75.07,21.57 56.93,14.47 11.58,10.12 12.23,11.22 43.71,36.46 28.76,25.91 30.35,21.29 29.02,28.02 38.72,35.22 35.97,38.07 36.17,35.17 36.02,32.87 43.72,38.17 51.62,39.42 49.67,39.42 67.82,37.17 67.72,39.62
  pour Bottom: 77.6,52.08 77.6,1.9 8.17,1.9 8.17,52.08
  pour Top: -0.05,54.1 85.88,54.1 85.88,36.04 78.49,36.04 78.49,16.8 85.8,16.8 85.8,0 -0.05,0
IN-
  Top 0.254: R37.1 74.93,7.87 | 74.93,7.87 73.24,7.87 U2.4 | R22.2 74.93,6.73 74.93,7.87
IO0_BOOT  (via drill 0.35)
  Top 0.254: U24.25 v61.49,27.44 v61.5,27.45 | v25.2,44.15 25.2,50.1 24.15,51.15 16.23,51.15 14.56,49.48 K1.2
  Bottom 0.254: v25.2,44.15 31.26,38.09 31.26,30.74 34.55,27.45 v61.5,27.45
IO2_TFT_RS  (via drill 0.35)
  Top 0.254: v47.3,21.97 47.4,21.97 48.62,20.75 U24.24
  Bottom 0.254: v47.3,21.97 46.03,23.24 J1.P$4
IO5_TF_CS
  Top 0.254: R67.2 40.88,18.53 40.88,17.47 42.13,16.22 SD1.2 42.13,13.47 42.43,13.17 42.43,13.15 62.81,13.15 66.57,16.92 U24.29
IO12_TFT_SDO/TP_OUT  (via drill 0.35)
  Top 0.254: v64.05,21.54 63.95,21.64 63.95,31.3 61.49,33.76 U24.14 60.07,33.84 R2.1 | U3.12 18.97,20.35 v18.97,22.03
  Bottom 0.254: v64.05,21.54 57.96,21.54 53.5,17.07 21.59,17.07 18.97,19.7 v18.97,22.03
IO13_TFT_SDI/TP_DIN  (via drill 0.35)
  Top 0.254: R29.1 43.48,20.14 v43.48,24.98 54.88,24.98 56.11,26.21 56.11,28.89 58.13,30.91 U24.16 | U3.14 20.26,22.66 v20.5,22.9
  Bottom 0.254: v43.48,24.98 43.35,24.84 J1.P$6 22.44,24.84 v20.5,22.9
IO14_TFT_CLK/TP_CLK  (via drill 0.35)  (2 unrouted)
  Top 0.254: U24.13 62.76,33.61 64.69,31.69 v64.69,25.64 | v45.34,21.15 44.69,20.5 44.69,20.05 | v22.8,21.05 22.07,20.32 U3.16
  Bottom 0.254: v64.69,25.64 64.54,25.79 57.34,25.79 52.71,21.16 45.36,21.16 v45.34,21.15 44.05,22.44 J1.P$3 | v22.8,21.05 22.8,21.97 23.24,22.41 25.08,22.41
IO15_TFT_CS  (via drill 0.35)
  Top 0.254: v53.25,22.75 53.98,22.02 U24.23
  Bottom 0.254: J1.P$5 51.96,24.04 v53.25,22.75
IO16_RXD2  (via drill 0.35)
  Top 0.254: U24.27 63.84,17.86 63.84,18.18 62.4,19.62 v62.4,28.4 | v32.35,39.25 31.28,40.32 J10.1
  Bottom 0.254: v62.4,28.4 36.95,28.4 32.35,33 v32.35,39.25
IO17_TXD2  (via drill 0.35)  (1 unrouted)
  Top 0.254: U24.28 65.21,17.76 65.21,18.63 63.1,20.74 v63.1,29.55 | v33.6,39.35 33.3,39.65 33.3,43.85
  Bottom 0.254: v33.6,39.35 33.6,33.4 37.45,29.55 v63.1,29.55
IO18_TF_SPI_CLK
  Top 0.254: U24.30 67.84,16.57 63.04,11.77 40.08,11.77 38.83,13.02 SD1.5
IO19_TF_SPI_MISO
  Top 0.254: R24.2 35.53,18.53 35.53,17.47 36.63,16.37 SD1.7 36.63,12.89 38.19,11.34 63.53,11.34 69.11,16.92 U24.31
IO21_SCL  (via drill 0.35)  (1 unrouted)
  Top 0.254: 49.53,35.59 v49.53,37.15 48.74,37.93 J6.1 | U24.33 71.65,21.7 v70.25,23.1
  Bottom 0.254: v70.25,23.1 70.25,27.13 66.9,30.47 52.1,30.47 49.53,33.05 v49.53,37.15
IO22_SDA  (via drill 0.35)
  Top 0.254: v50.88,37.23 50.88,37.14 | U24.36 75.46,19.49 71.95,23 v71.9,23 | v50.88,37.23 50.88,44.11 J6.2 | v50.88,37.23 R27.1
  Bottom 0.254: v71.9,23 71.9,27.1 67.8,31.2 52.65,31.2 50.88,32.98 v50.88,37.23
IO23_TF_SPI_MOSI  (via drill 0.35)
  Top 0.254: R23.2 39.58,17.57 41.03,16.12 SD1.3 41.03,12.87 41.53,12.37 41.53,12.35 62.65,12.35 v62.65,12.45 | U24.37 76.73,14.01 75.12,12.4 v74.98,12.4
  Bottom 0.254: v74.98,12.4 74.92,12.45 v62.65,12.45
IO25_PROT_A/D  (via drill 0.35)
  Top 0.254: v66.53,33.8 66.57,33.84 U24.10 66.57,40.68 66.05,41.2 66.05,44.12 J7.1 | R18.1 53.92,32.93 54.19,32.66 v55.19,32.66
  Bottom 0.254: v66.53,33.8 65.93,33.2 56.23,33.2 55.69,32.66 v55.19,32.66
IO26_SPEAK  (via drill 0.35)
  Top 0.254: U24.11 65.3,33.37 65.9,32.77 65.9,20.78 66.89,19.79 68.29,19.79 v68.44,19.64 | v72.02,16.15 72.04,16.13 72.04,13.87 R12.1
  Bottom 0.254: v72.02,16.15 72.02,16.2 68.58,19.64 v68.44,19.64
IO27_LCD_BLK_CTR  (via drill 0.35)
  Top 0.254: U24.12 64.03,33.94 65.4,32.57 v65.4,19.52 | v15.9,26.72 14.51,26.72 Q6.1 14.42,26.62 R38.1
  Bottom 0.254: v65.4,19.52 59.36,19.52 55.12,15.28 20.66,15.28 15.9,20.04 v15.9,26.72
IO32_PROT_A/D  (via drill 0.35)
  Top 0.254: v68.95,33.25 69.11,33.41 U24.8 69.11,40.34 68.22,41.23 J7.2 | v57.85,32.15 56.85,32.15 55.35,33.65 R1.1
  Bottom 0.254: v68.95,33.25 67.85,32.15 v57.85,32.15
IO33_TP_CS  (via drill 0.35)
  Top 0.254: U24.9 67.84,33.37 66.69,32.22 66.69,22.39 v66.72,22.37 | U3.15 20.9,19.51 v22.31,18.09
  Bottom 0.254: v66.72,22.37 66.57,22.52 56.8,22.52 52.37,18.09 v22.31,18.09
IO36_TP_IRQ  (via drill 0.35)
  Top 0.254: v67.5,20.6 67.5,30.4 69.62,32.52 72.24,32.52 74.19,34.47 U24.4 | U3.11 18.36,21.24 v17.6,22 16.9,22 16,21.1 16,20.6 R10.1
  Bottom 0.254: v67.5,20.6 58.75,20.6 54.45,16.3 21.09,16.3 17.6,19.79 v17.6,22
N$1
  Top 0.254: LED1.+ 3.62,26.08 R3.1
N$2
  Top 0.254: R7.2 15.04,24 Q6.3
N$3
  Top 0.254: R12.2 70.17,13.02 R19.1 C46.2
N$4
  Top 0.254: U3.7 17.72,26.95 16.72,27.95 R35.2
N$5
  cutout Top: 76.56,5.13 76.89,5.13 76.89,4.29 76.56,4.29
N$12  (via drill 0.35)
  Top 0.254: R7.1 15.02,22.1 16.32,23.4 19.05,23.4 19.6,23.95 v19.6,24.45
  Bottom 0.254: J1.P$14 25.31,29.73 J1.P$11 25.29,28.86 23.26,28.86 19.6,25.2 v19.6,24.45
  Bottom 0.5: J1.P$12 J1.P$11 | J1.P$13 25.31,29.73
N$13
  Top 0.8: L4.1 27.61,2.62 22.48,2.62 U1.3
N$14
  Top 0.254: J3.B5 9.94,36.3 12.92,33.33 12.92,29.71 R33.1
N$16  (1 unrouted)
  Top 0.254: 8.13,39.36 10.32,39.36 R34.2
N$20
  Top 0.254: U1.5 20.42,4.85 R21.1 R20.2
N$26
  Top 0.254: C51.2 67.57,11.08 68,10.65 69.7,10.65 70.17,11.12 R19.2 70.17,11.25 71.83,9.59 76.26,9.59 77.85,8 77.85,5.3 77.83,5.28 C14.1
N$29
  Top 0.254: C14.2 76.43,6.56 R22.1
N$40  (via drill 0.35)
  Top 0.254: R72.2 72.74,11.19 v72.11,10.56 | v22.25,38.85 22.23,38.87 U6.2
  Bottom 0.254: v72.11,10.56 70.86,9.31 24.54,9.31 14.65,19.2 14.65,31.2 22.25,38.8 v22.25,38.85
N$42  (via drill 0.35)
  Top 0.254: R71.2 74.07,10.92 v73.7,10.55 | v20.9,38.85 20.9,40.38 U6.3
  Bottom 0.254: v73.7,10.55 73.65,10.55 71.6,8.5 24.15,8.5 13.95,18.7 13.95,31.65 20.9,38.6 v20.9,38.85
N$47
  Top 0.254: R16.2 42.08,18.58 42.08,17.62 43.23,16.47 SD1.1
N$48
  Top 0.254: R17.2 34.33,18.45 34.33,17.12 35.53,15.92 SD1.8
TP_X+  (via drill 0.35)
  Top 0.254: U3.2 20.9,26.83 21.94,27.87 C18.2 22.07,29.57 v22.8,30.3
  Bottom 0.254: J1.P$15 23.35,32.04 22.8,31.49 v22.8,30.3
TP_X-  (via drill 0.35)
  Top 0.254: C20.2 19.38,29.55 19.38,27.82 v19.62,27.57 v19.63,27.57 U3.4
  Bottom 0.254: J1.P$17 23.42,33.64 21.3,31.52 21.3,28.17 20.6,27.47 19.72,27.47 v19.62,27.57
TP_Y+  (via drill 0.35)
  Top 0.254: C19.2 20.66,28.48 v20.62,28.48 20.62,27.43 20.26,27.07 U3.3
  Bottom 0.254: v20.62,28.48 20.62,31.72 23.53,34.63 25.12,34.63 J1.P$18
TP_Y-  (via drill 0.35)  (1 unrouted)
  Top 0.254: U3.5 18.99,26.86 18.07,27.78 v18.07,28.33 18.07,29.66
  Bottom 0.254: J1.P$16 23.38,32.84 21.76,31.21 21.76,28.02 20.53,26.79 19.06,26.79 18.07,27.78 v18.07,28.33
UART0_RXD0
  Top 0.254: U24.34 73.24,17.35 73.24,13.77 R72.1
UART0_TXD0
  Top 0.254: U24.35 74.54,17.32 74.54,14.07 74.07,13.59 R71.1
USB_D+
  Top 0.254: R32.2 12.39,37.19 12.39,37.21 12.98,37.8 16.5,37.8 18.42,39.72 U6.5
USB_D-
  Top 0.254: R11.2 12.38,38.45 16.25,38.45 17.15,39.35 U6.6
VBUS  (6 unrouted)
  Top 0.5: 6.96,40.51 7.02,40.45
  Top 0.65: 7.93,35.65 6.9,35.65 5.75,36.8 5.75,39.3 6.96,40.51 | 7.02,40.45 7.78,40.45 | 8.24,35.65 9.2,35.65
  Top 0.75: 9.2,35.65 9.75,35.1
  Top 0.8: 17.2,13.38 17.01,13.38 15.96,12.34 R15.2 11.74,12.35 10.19,10.8 10.19,8.12
  Top 1: D3.1 17.2,13.38 16.42,13.38 9.75,20.05 9.75,35.1
VIN  (2 unrouted)
  Top 0.203: 16.21,4.18 C6.2
  Top 0.5: U1.1 20.38,2.92 U1.4
  Top 0.65: D3.2 17.31,8.22 17.11,8.02 18.11,7.03 | C6.2 17.96,4.14 C42.2 18.51,4.29 U1.1
  Top 1: U8.P$3 17.31,8.22 | C42.2 18.11,7.03
VO1  (via drill 0.5)
  Top 0.254: J8.P$1 55.01,7.25 | U2.5 67.42,7.39 | 76.61,7.92 R37.2
  Top 0.5: v53.9,7.25 55.01,7.25 | 67.42,7.39 v65.67,7.39 | U2.5 68.88,8.84 75.7,8.84 76.61,7.92
  Bottom 0.5: v65.67,7.39 65.57,7.29 53.94,7.29 v53.9,7.25
VO2  (via drill 0.5)  (1 unrouted)
  Top 0.254: U2.8 67.09,3.61 | 56.99,7.19 57.15,7.35
  Top 0.5: 67.09,3.61 65.7,5 v65.7,5.35 | v56.99,5.34 56.99,7.19
  Bottom 0.254: v56.99,5.34 57.01,5.35
  Bottom 0.5: v65.7,5.35 57.01,5.35

### Text on the board
tPlace: GND | IO25 | IO32 | 3V3 | GND | IO16_RXD2 | IO17_TXD2 | 3V3 | IO21_SCL | IO22_SDA | 3V3 | GND | www.elecrow.com | + | V1.0 | IO26-SPK | - | VON- | VOP+
tNames: GND | 5V
tStop: Wizee-ESP32 | WZ2432R028